# EAGLE design AmigaUSBMouse (EAGLE 8.7.1)
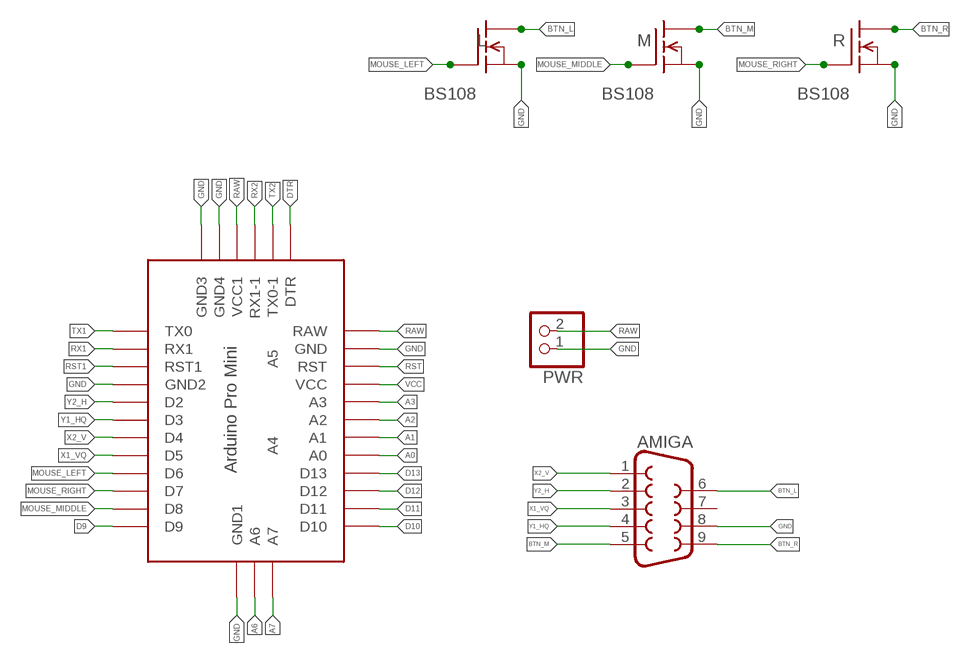
[diagram p0: schematic, sheet 1]

## Parts
AMIGA  DB9FEMALE  [DB9]
L  BS108  FQN1N50CI  [TO92-INLINE]
M  BS108  FQN1N50CI  [TO92-INLINE]
PWR  PINHD-1X2  [1X02]
R  BS108  FQN1N50CI  [TO92-INLINE]
U$1  ABK-PRO-MINI  [ABK-PRO-MINI]

## Nets
A0: U$1.A0
A1: U$1.A1
A2: U$1.A2
A3: U$1.A3
A6: U$1.A6
A7: U$1.A7
BTN_L: AMIGA.6 L.1(D)
BTN_M [_20]: AMIGA.5 M.1(D)
BTN_R [_20]: AMIGA.9 R.1(D)
D9: U$1.D9
D10: U$1.D10
D11: U$1.D11
D12: U$1.D12
D13: U$1.D13
DTR: U$1.DTR
GND [_20]: AMIGA.8 L.3(S) M.3(S) PWR.1 R.3(S) U$1.GND U$1.GND1(GND2) U$1.GND2(GND3) U$1.GND3(GND4) U$1.GND4(GND1)
MOUSE_LEFT [_20]: L.2(G) U$1.D6
MOUSE_MIDDLE [_20]: M.2(G) U$1.D8
MOUSE_RIGHT [_20]: R.2(G) U$1.D7
RAW [_20]: PWR.2 U$1.RAW U$1.VCC1
RST: U$1.RST
RST1: U$1.RST1
RX1: U$1.RX1
RX2: U$1.RX1-1
TX1: U$1.TX0
TX2: U$1.TX0-1
VCC: U$1.VCC
X1_VQ [_20]: AMIGA.3 U$1.D5
X2_V: AMIGA.1 U$1.D4
Y1_HQ [_20]: AMIGA.4 U$1.D3
Y2_H [_20]: AMIGA.2 U$1.D2
Unconnected: AMIGA.7 U$1.A4 U$1.A5

## Library data of the parts
AMIGA = SparkFun-Connectors:DB9: DB9 Connector Standard DB9 (D-Sub 9) serial connector. Can be used for CAN bus as well as RS485 and RS232. Footprint production proven. Here is the female version connector we sell at SparkFun: 9 Pin Female Serial Connector - PCB Mount <https://www.sparkfun.com/products/429> (PRT-00429) This connector has been used on the following SparkFun products: SparkFun RS232 Shifter - SMD <https://www.sparkfun.com/products/449> (PRT-00449) SparkFun RS232 Shifter SMD (No DB9) <https://www.sparkfun.com/products/8780> (PRT-08780); PROD_ID: CONN-08194
L M R = adafruit:FQN1N50C: N-Channel Enhancement MOSFET 500V, 0.4A, 6.0 Ohm
PWR = pinhead:PINHD-1X2: PIN HEADER
U$1 = Arduino-clone:ABK-PRO-MINI: ABK Pro-Mini Arduino Clone

## Net classes
0 default: width 0.406 mm
1 _20: width 0.508 mm

## Board
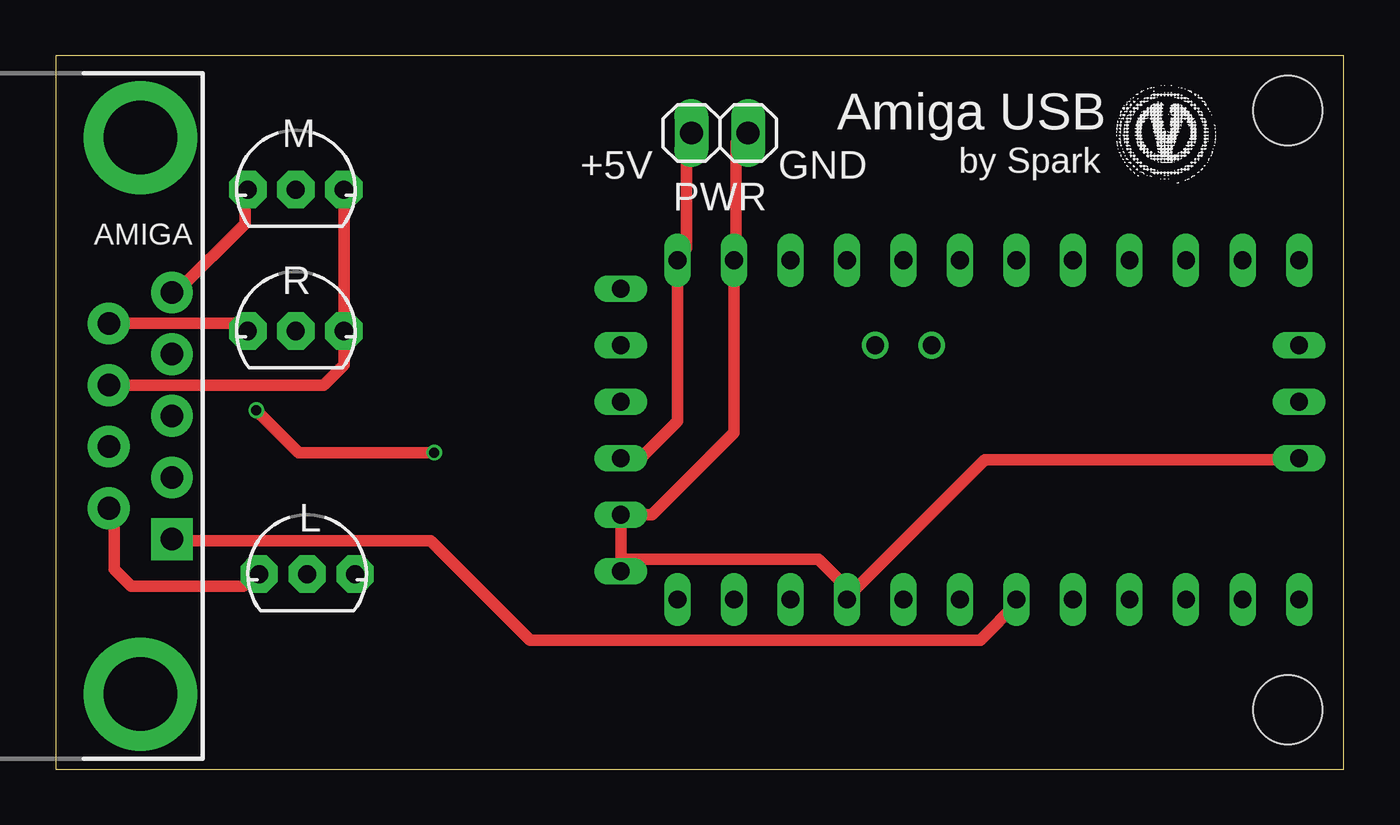
[diagram p1: board, top side]
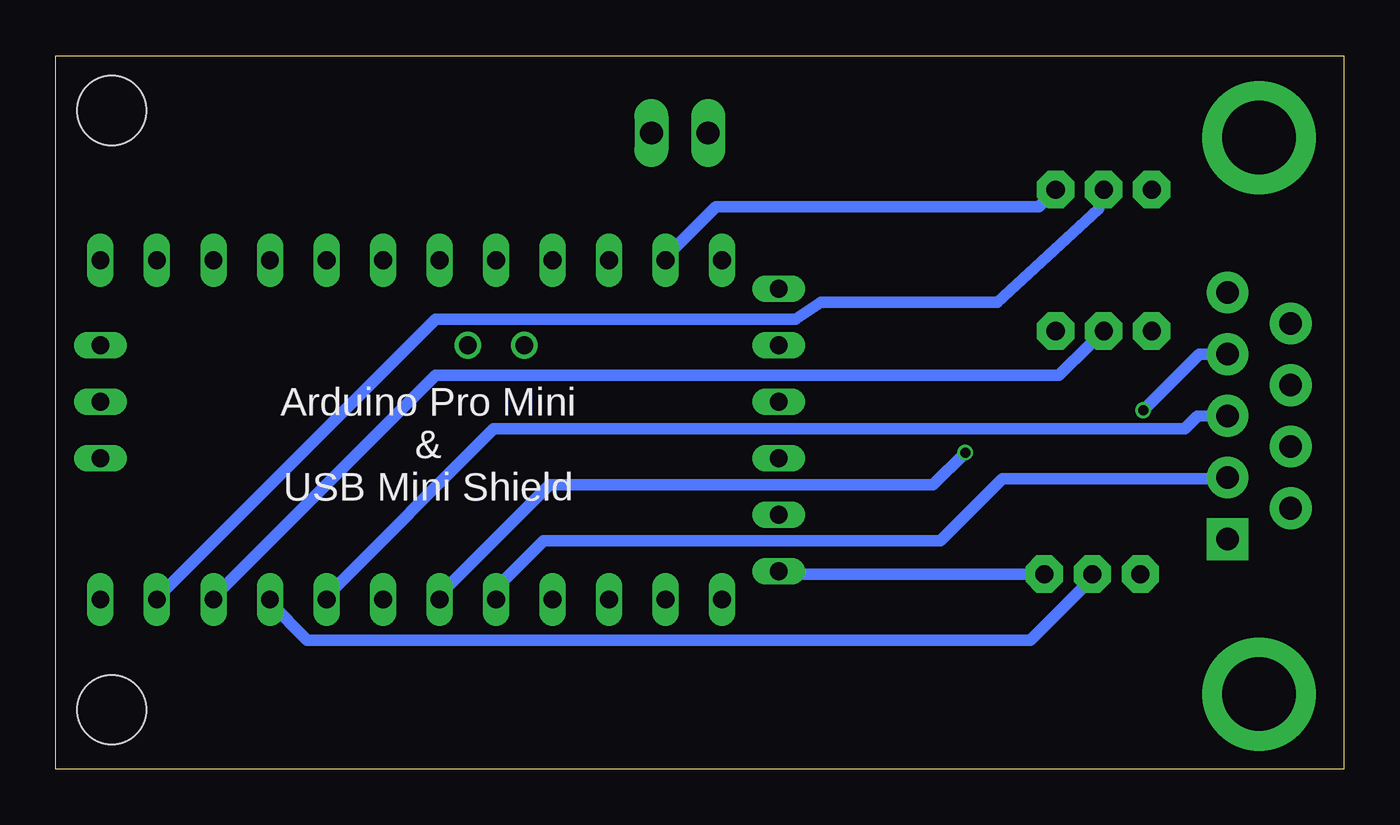
[diagram p2: board, bottom side, seen from below]

Size 57.89 x 32.05 mm. Coordinates in mm from the lower left corner, seen from the top.
Outline: 0,0 57.89,0 57.89,32.05 0,32.05 0,0
Copper layers (1*16): Top 0.035559375mm / dielectric 1.6mm / Bottom 0.035559375mm
Design rules "oshpark-2layer": minimum track width 6mil, minimum drill 10mil, track to track 6mil, track to pad 6mil, pad to pad 6mil, via to via 6mil, smd to smd 6mil, copper to edge 15mil, drill to drill 6mil, minimum pad ring 5mil, minimum via ring 5mil, stop-mask expansion 2.5mil, vias tented up to drill 0mil, thermal gap 10mil
Holes 3.1 mm at 55.37,29.59 55.37,2.67

### Footprints (pad centres in the part's own frame; a part is rotated, then mirrored left to right if it is on the bottom)
DB9 = drill 1.016 pad 1.88 square: 1 -5.54,-1.42 | drill 1.016 pad 1.88: 2 -2.77,-1.42; 3 0,-1.42; 4 2.77,-1.42; 5 5.54,-1.42; 6 -4.15,1.42; 7 -1.38,1.42; 8 1.38,1.42; 9 4.15,1.42 | drill 3.302 pad 5.08: G1 -12.5,0; G2 12.5,0
TO92-INLINE = drill 0.813 pad 1.676 octagon: 1 -2.159,0; 2 0,0; 3 2.159,0
1X02 = drill 1.016 long: 1 -1.27,0; 2 1.27,0
ABK-PRO-MINI = drill 0.8 long: A0 10.16,-3.81; A1 10.16,-6.35; A2 10.16,-8.89; A3 10.16,-11.43; A6 3.81,-21.59; A7 6.35,-21.59; D2 -5.08,-3.81; D3 -5.08,-6.35; D4 -5.08,-8.89; D5 -5.08,-11.43; D6 -5.08,-13.97; D7 -5.08,-16.51; D8 -5.08,-19.05; D9 -5.08,-21.59; D10 10.16,-21.59; D11 10.16,-19.05; D12 10.16,-16.51; D13 10.16,-13.97; DTR 8.89,8.89; GND 10.16,3.81; GND1 -5.08,-1.27; GND2 -3.81,8.89; GND3 -1.27,8.89; GND4 1.27,-21.59; RAW 10.16,6.35; RST 10.16,1.27; RST1 -5.08,1.27; RX1 -5.08,3.81; RX1-1 3.81,8.89; TX0 -5.08,6.35; TX0-1 6.35,8.89; VCC 10.16,-1.27; VCC1 1.27,8.89 | drill 0.8: A4 6.35,-5.08; A5 6.35,-2.54

### Placement (x,y rotation side)
AMIGA  3.81,15.88 90 top
L  11.3,8.76 0 top
M  10.79,26.04 0 top
PWR  29.84,28.57 180 top
R  10.79,19.68 0 top
U$1  34.29,12.7 90 top

### Tracks (layer width: path | path; a pad name or v marks a point on that pad's centre or on a via)
BTN_L
  Top 0.508: L.1 8.43,8.23 3.4,8.23 2.64,8.99 2.64,11.66 AMIGA.6
BTN_M
  Top 0.508: M.1 8.51,25.91 8.51,24.51 5.44,21.44 AMIGA.5
BTN_R
  Top 0.508: R.1 8.51,19.76 8.53,19.76 8.26,20.04 2.64,20.04 AMIGA.9
GND
  Top 0.508: 25.55,9.42 25.55,9.14 U$1.GND2 | 25.55,11.38 U$1.GND3 | 25.55,9.42 34.29,9.42 35.33,8.38 U$1.GND1 35.61,7.75 41.76,13.89 55.73,13.89 U$1.GND4 | 25.55,9.42 U$1.GND2 | PWR.1 30.86,28.42 30.58,28.14 30.58,23.11 U$1.GND 30.48,15.11 26.8,11.43 U$1.GND3 | M.3 R.3 12.95,18.16 12.05,17.25 AMIGA.8 | U$1.GND3 U$1.GND2
  Bottom 0.508: U$1.GND 30.3,23.11 30.38,23.11 28.22,25.27 13.72,25.27 M.3 | L.3 25.27,8.76 U$1.GND2
MOUSE_LEFT
  Bottom 0.508: U$1.D6 48.18,7.47 48.26,7.47 46.58,5.79 14.1,5.79 11.3,8.59 L.2
MOUSE_MIDDLE
  Bottom 0.508: U$1.D8 53.21,7.75 53.29,7.75 40.82,20.22 24.64,20.22 23.5,20.98 15.57,20.98 11.02,25.15 M.2
MOUSE_RIGHT
  Bottom 0.508: U$1.D7 50.39,8.13 40.82,17.7 12.8,17.7 12.55,17.96 R.2
RAW
  Top 0.508: PWR.2 28.35,28.42 28.35,23.39 28.07,23.11 U$1.RAW 27.94,15.62 26.29,13.97 U$1.VCC1
X1_VQ
  Bottom 0.508: U$1.D5 45.67,7.75 45.74,7.75 38.2,15.29 7.14,15.29 6.58,15.85 AMIGA.3
X2_V
  Top 0.406: 43.23,7.47 43.15,7.47
  Top 0.508: 43.23,7.47 41.55,5.79 21.31,5.79 16.84,10.26 5.44,10.26 AMIGA.1 | 43.15,7.47 U$1.D4
Y1_HQ  (via drill 0.45 pad 0.6)
  Top 0.508: v9.02,16.13 10.92,14.22 v17.02,14.22
  Bottom 0.508: U$1.D3 40.64,7.75 40.72,7.75 35.69,12.78 18.47,12.78 v17.02,14.22 | AMIGA.4 6.5,18.64 v9.02,16.13
Y2_H
  Bottom 0.508: U$1.D2 37.85,8.38 35.97,10.26 18.14,10.26 15.34,13.06 5.28,13.06 AMIGA.2

### Text on the board
tNames: Amiga USB | +5V | GND | by Spark
bNames: Arduino Pro Mini / & / USB Mini Shield